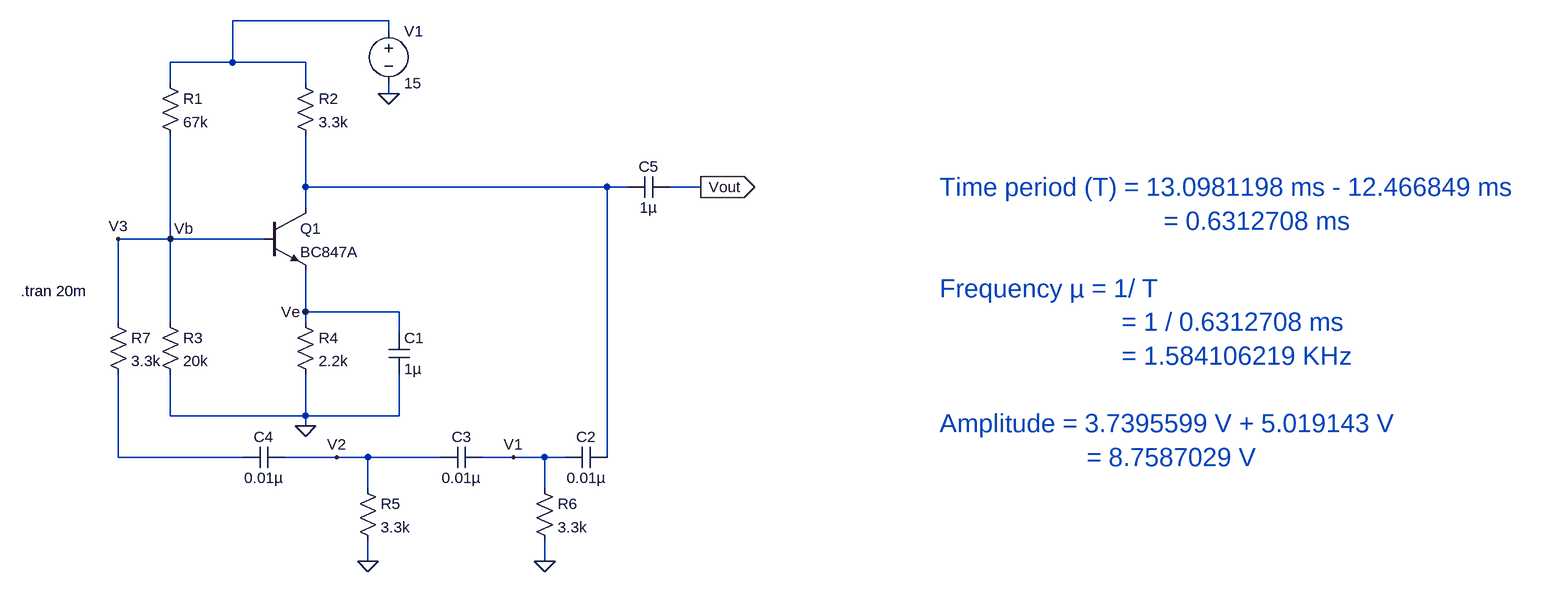
[diagram p0: schematic RC_phase_shift_OSC.asc]
RC_phase_shift_OSC.asc, the LTspice schematic file:
Version 4
SHEET 1 2584 744
WIRE 512 -160 272 -160
WIRE 512 -144 512 -160
WIRE 272 -96 272 -160
WIRE 272 -96 176 -96
WIRE 384 -96 272 -96
WIRE 176 -64 176 -96
WIRE 384 -64 384 -96
WIRE 512 -48 512 -64
WIRE 384 96 384 16
WIRE 848 96 384 96
WIRE 880 96 848 96
WIRE 992 96 944 96
WIRE 384 128 384 96
WIRE 176 176 176 16
WIRE 176 176 96 176
WIRE 320 176 176 176
WIRE 384 288 384 224
WIRE 528 288 384 288
WIRE 96 304 96 176
WIRE 176 304 176 176
WIRE 384 304 384 288
WIRE 528 320 528 288
WIRE 176 448 176 384
WIRE 384 448 384 384
WIRE 384 448 176 448
WIRE 528 448 528 384
WIRE 528 448 384 448
WIRE 384 464 384 448
WIRE 96 512 96 384
WIRE 288 512 96 512
WIRE 432 512 352 512
WIRE 480 512 432 512
WIRE 592 512 480 512
WIRE 704 512 656 512
WIRE 752 512 704 512
WIRE 784 512 752 512
WIRE 848 512 848 96
WIRE 480 560 480 512
WIRE 752 560 752 512
WIRE 480 672 480 640
WIRE 752 672 752 640
FLAG 512 -48 0
FLAG 384 464 0
FLAG 480 672 0
FLAG 752 672 0
FLAG 992 96 Vout
IOPIN 992 96 Out
FLAG 176 176 Vb
FLAG 96 176 V3
FLAG 432 512 V2
FLAG 704 512 V1
FLAG 384 288 Ve
SYMBOL npn 320 128 R0
SYMATTR InstName Q1
SYMATTR Value BC847A
SYMBOL res 160 -80 R0
SYMATTR InstName R1
SYMATTR Value 67k
SYMBOL res 368 -80 R0
SYMATTR InstName R2
SYMATTR Value 3.3k
SYMBOL res 160 288 R0
SYMATTR InstName R3
SYMATTR Value 20k
SYMBOL res 368 288 R0
SYMATTR InstName R4
SYMATTR Value 2.2k
SYMBOL voltage 512 -160 R0
WINDOW 123 0 0 Left 0
WINDOW 39 0 0 Left 0
SYMATTR InstName V1
SYMATTR Value 15
SYMBOL cap 512 320 R0
SYMATTR InstName C1
SYMATTR Value 1µ
SYMBOL cap 848 496 R90
WINDOW 0 0 32 VBottom 2
WINDOW 3 32 32 VTop 2
SYMATTR InstName C2
SYMATTR Value 0.01µ
SYMBOL cap 656 496 R90
WINDOW 0 0 32 VBottom 2
WINDOW 3 32 32 VTop 2
SYMATTR InstName C3
SYMATTR Value 0.01µ
SYMBOL cap 352 496 R90
WINDOW 0 0 32 VBottom 2
WINDOW 3 32 32 VTop 2
SYMATTR InstName C4
SYMATTR Value 0.01µ
SYMBOL res 464 544 R0
SYMATTR InstName R5
SYMATTR Value 3.3k
SYMBOL res 736 544 R0
SYMATTR InstName R6
SYMATTR Value 3.3k
SYMBOL cap 944 80 R90
WINDOW 0 0 32 VBottom 2
WINDOW 3 32 32 VTop 2
SYMATTR InstName C5
SYMATTR Value 1µ
SYMBOL res 80 288 R0
SYMATTR InstName R7
SYMATTR Value 3.3k
TEXT -54 256 Left 2 !.tran 20m
TEXT 1360 96 Left 4 ;Time period (T) = 13.0981198 ms - 12.466849 ms\n                                = 0.6312708 ms\n \nFrequency µ = 1/ T\n                          = 1 / 0.6312708 ms\n                          = 1.584106219 KHz\n \nAmplitude = 3.7395599 V + 5.019143 V\n                     = 8.7587029 V

The netlist it stands for:
* RC_phase_shift_OSC.asc
Q1 N002 V3 Ve 0 BC847A
R1 N001 V3 67k
R2 N001 N002 3.3k
R3 V3 0 20k
R4 Ve 0 2.2k
V1 N001 0 15
C1 Ve 0 1µ
C2 N002 V1 0.01µ
C3 V1 V2 0.01µ
C4 V2 N003 0.01µ
R5 V2 0 3.3k
R6 V1 0 3.3k
C5 Vout N002 1µ
R7 V3 N003 3.3k
.model NPN NPN
.model PNP PNP
.lib standard.bjt
.tran 20m
* Time period (T) = 13.0981198 ms - 12.466849 ms
*                                 = 0.6312708 ms
* Frequency µ = 1/ T
*                           = 1 / 0.6312708 ms
*                           = 1.584106219 KHz
* Amplitude = 3.7395599 V + 5.019143 V
*                      = 8.7587029 V
.backanno
.end